# Altium schematic sheet #Altium_stm_BMS_Buck_boost.SchDoc
size A; SheetNumber: 1; SheetTotal: 3
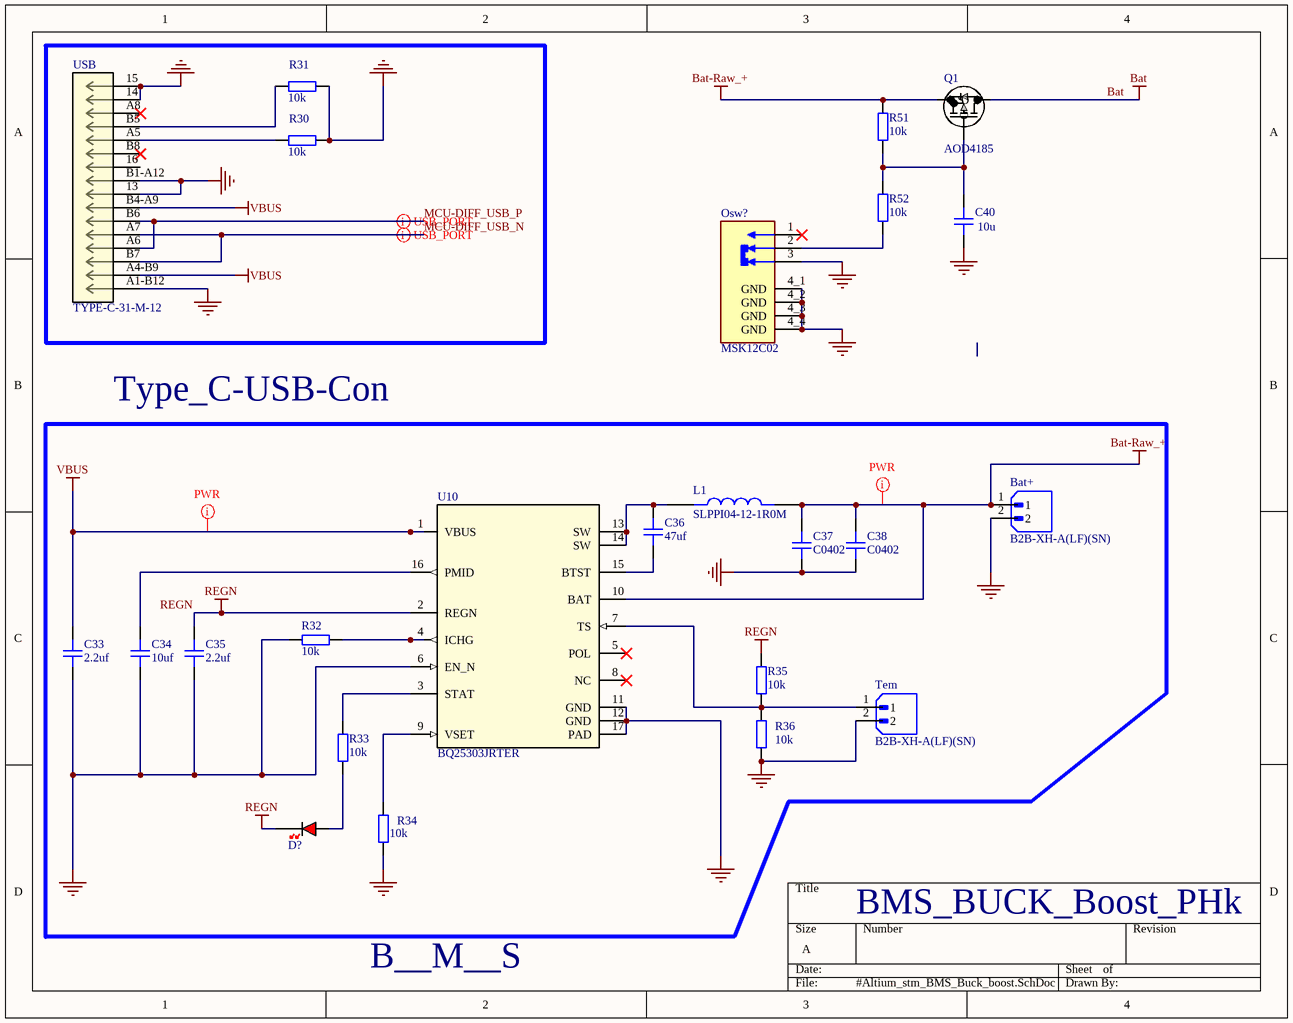
[diagram p0: #Altium_stm_BMS_Buck_boost.SchDoc]

## Parts
Bat+  B2B-XH-A(LF)(SN)  [JST_B2B-XH-A(LF)(SN)]
C33  2.2uf  [CAP_0603]
C34  10uf  [CAP_0603]
C35  2.2uf  [CAP_0402]
C36  47uf  [CAP_1206]
C37  C0402  [CAP_0402]
C38  C0402  [CAP_0402]
C40  10u  [CAP_0603]
D?  RED  [LED_0402_RED]  (value not drawn)
L1  SLPPI04-12-1R0M  [IND_SLPPI04-12-1R0M]
Osw?  MSK12C02  [SW_MSK12C02]
Q1  AOD4185  [TO252_AOS]
R30  10k  [RES_0402]
R31  10k  [RES_0402]
R32  10k  [RES_0402]
R33  10k  [RES_0402]
R34  10k  [RES_0402]
R35  10k  [RES_0402]
R36  10k  [RES_0402]
R51  10k  [RES_0402]
R52  10k  [RES_0402]
Tem  B2B-XH-A(LF)(SN)  [JST_B2B-XH-A(LF)(SN)]
U10  BQ25303JRTER  [RTE0016C]
USB  TYPE-C-31-M-12  [CONN12_C-31-M-12_HRO]

## Blocks framed on the sheet
Type_C-USB-Con: Bat+ C33-C38 D? L1 R32-R36 Tem U10

## Nets
Bat: Q1.2(D)
Bat-Raw_+: Bat+.1 C37.2 C38.2 L1.2 Q1.3(S) R51.2 U10.10(BAT)
GND: Bat+.2 C33.1 C34.1 C35.1 C37.1 C38.1 C40.1 Osw?.3 Osw?.4_1(GND) Osw?.4_2(GND) Osw?.4_3(GND) Osw?.4_4(GND) R30.2 R31.2 R32.1 R34.1 R36.1 Tem.2 U10.6(EN_N) U10.11(GND) U10.12(GND) U10.17(PAD) USB.13 USB.14 USB.15 USB.A1-B12 USB.B1-A12
REGN: C35.2 D?.K R35.2 U10.2(REGN)
VBUS: C33.2 U10.1(VBUS) USB.A4-B9 USB.B4-A9
MCU-DIFF_USB_N: USB.A7 USB.B7
MCU-DIFF_USB_P: USB.A6 USB.B6
NetC34_2: C34.2 U10.16(PMID)
NetC36_1: C36.1 U10.15(BTST)
NetC36_2: C36.2 L1.1 U10.13(SW) U10.14(SW)
NetC40_2: C40.2 Q1.1(G) R51.1 R52.2
NetD?_A: D?.A R33.1
NetOsw?_2: Osw?.2 R52.1
NetR30_1: R30.1 USB.A5
NetR31_1: R31.1 USB.B5
NetR32_2: R32.2 U10.4(ICHG)
NetR33_2: R33.2 U10.3(STAT)
NetR34_2: R34.2 U10.9(VSET)
NetR35_1: R35.1 R36.2 Tem.1 U10.7(TS)

Not connected (* = marked no-connect by the designer): Osw? 1*; U10 5(POL)* 8(NC)*; USB 16 A8* B8*

## Layout directives
differential pair; differential pair class USB_PORT: MCU-DIFF_USB_N, MCU-DIFF_USB_P
mark named PWR: Bat-Raw_+, VBUS

## Notes on the sheet
- B__M__S
- BMS_BUCK_Boost_PHk

## Library data of the parts
Bat+ Tem = B2B-XH-A(LF)(SN): Connector Header Through Hole 2 position 0.098 (2.50mm); MF: JST Sales; SnapEDA_Link: https://www.snapeda.com/parts/B2B-XH-A(LF)(SN)/JST/view-part/?ref=snap; Package: None; Value: *; MP: B2B-XH-A(LF)(SN); Check_prices: https://www.snapeda.com/parts/B2B-XH-A(LF)(SN)/JST/view-part/?ref=eda
C33 C34 C40 = CAP_0603: Capacitor SMD 0603; Manufacturer: *; Manufacturer Part Number: *; Distributor Link: *; LCSC: *; Rating: *; Dielectric: *
C35 C37 C38 = CAP_0402: Capacitor SMD 0402; Manufacturer: *; Manufacturer Part Number: *; Distributor Link: *; LCSC: *; Rating: *; Dielectric: *
C36 = CAP_1206: Capacitor SMD 1206; Manufacturer: *; Manufacturer Part Number: *; Distributor Link: *; LCSC: *; Rating: *; Dielectric: *
D? = LED_0402_RED: LED 0402 RED SMD
Q1 = AOD4185: Description; Manufacturer_Name: Alpha and Omega Semiconductor; Copyright: Copyright (C) 2025 Ultra Librarian. All rights reserved.; Manufacturer_Part_Number: AOD4185
R30-R36 R51 R52 = RES_0402: Resistor SMD 0402; Manufacturer: *; Manufacturer Part Number: *; Distributor Link: *; LCSC: *
U10 = BQ25303JRTER: Standalone 1-cell 17-V, 3.0-A battery charger with JEITA battery temperature monitoring 16-WQFN -40 to 85; Manufacturer_Name: Texas Instruments; TYPE: TYPE; RefDes: RefDes; Copyright: Copyright (C) 2025 Ultra Librarian. All rights reserved.; Manufacturer_Part_Number: BQ25303JRTER
USB = TYPE-C-31-M-12: Description; Manufacturer_Name: HRO Electronics; Copyright: Copyright (C) 2025 Ultra Librarian. All rights reserved.; Manufacturer_Part_Number: TYPE-C-31-M-12; RefDes: RefDes; Type: Type
L1 = SLPPI04-12-1R0M: Price: None; Availability: Unavailable; Value: *; MP: SLPPI04-12-1R0M; Package: None
Osw? = MSK12C02: Package: None; Price: None; Value: *; MP: MSK12C02; Availability: Unavailable